# Altium schematic sheet MPPTcharger.SchDoc
size A; SheetNumber: 1; SheetTotal: 10
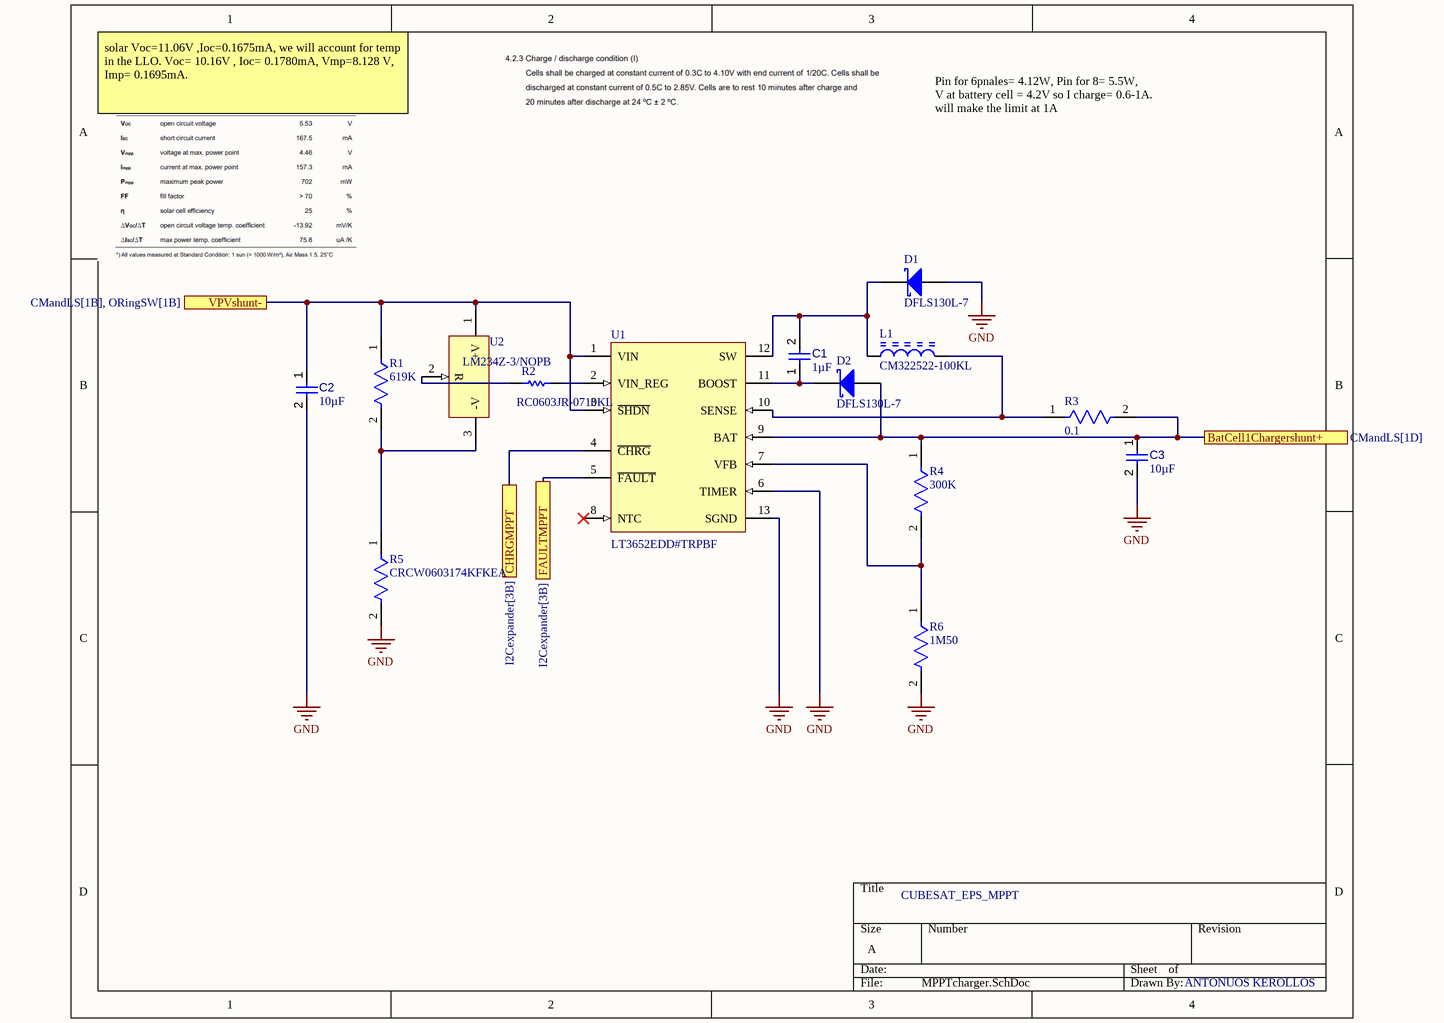
[diagram p0: MPPTcharger.SchDoc]

## Parts
C1  value 1µF  [CAPC0402(1005)60_L]  (hidden comment: Capacitor 1µF +/-20% 10V 0402)
C2  value 10µF  [CAPC0402(1005)60_L]  (hidden comment: Capacitor 10µF +/-40% 6.3V 0402)
C3  value 10µF  [CAPC0402(1005)60_L]  (hidden comment: Capacitor 10µF +/-40% 6.3V 0402)
D1  DFLS130L-7  [DIOD-POWERDI123-2_A_V]
D2  DFLS130L-7  [DIOD-POWERDI123-2_A_V]
L1  CM322522-100KL  [BOUR-CM322522_V]
R1  619K  [FP-CRCW0805-e3-IPC_C]
R2  RC0603JR-0710KL  [RESC1608X55X25ML10T15]
R3  0.1  [FP-ERJ8BW-IPC_A]
R4  300K  [FP-CRCW0402-e3-IPC_C]
R5  CRCW0603174KFKEA  [FP-CRCW0603-e3-IPC_B]
R6  1M50  [FP-CRCW0402-e3-IPC_C]
U1  LT3652EDD#TRPBF  [LT-DD-12_V]
U2  LM234Z-3/NOPB  [LP0003A]

## Ports
BatCell1Chargershunt+ (see CMandLS[1D]), CHRGMPPT (see I2Cexpander[3B]), FAULTMPPT (see I2Cexpander[3B]), VPVshunt- (see CMandLS[1B], ORingSW[1B])

## Nets
GND: C2.2 C3.2 D1.1(A) R5.2 R6.2 U1.6(TIMER) U1.13(SGND)
BatCell1Chargershunt+: C3.1 D2.1(A) R3.2 R4.1 U1.9(BAT) ; port BatCell1Chargershunt+
CHRGMPPT: U1.4(~{CHRG}) ; port CHRGMPPT
FAULTMPPT: U1.5(~{FAULT}) ; port FAULTMPPT
VPVshunt-: C2.1 R1.1 U1.1(VIN) U1.3(~{SHDN}) U2.1(+V) ; port VPVshunt-
NetC1_1: C1.1 D2.2(K) U1.11(BOOST)
NetC1_2: C1.2 D1.2(K) L1.1 U1.12(SW)
NetL1_2: L1.2 R3.1 U1.10(SENSE)
NetR1_2: R1.2 R5.1 U2.3(-V)
NetR2_1: R2.1 U1.2(VIN_REG)
NetR2_2: R2.2 U2.2(R)
NetR4_2: R4.2 R6.1 U1.7(VFB)

Not connected (* = marked no-connect by the designer): U1 8(NTC)*

## Notes on the sheet
- solar Voc=11.06V ,Ioc=0.1675mA, we will account for temp in the LLO. Voc= 10.16V , Ioc= 0.1780mA, Vmp=8.128 V, Imp= 0.1695mA.
- Pin for 6pnales= 4.12W, Pin for 8= 5.5W,                 V at battery cell = 4.2V so I charge= 0.6-1A.                      will make the limit at 1A
- CUBESAT_EPS_MPPT
- ANTONUOS KEROLLOS

## Library data of the parts
C1 = CMP-001-00063-3: Chip Capacitor, 1µF +/-20%, 10V, 0402, Thickness 0.6 mm; Tolerance: 10%; Mounting Technology: SMT; Max Operating Temperature: 85°C; Voltage Rating: 10V; Pins: 2; Case/Package: 0402; Min Operating Temperature: -55°C
C2 C3 = CMP-001-00074-3: Chip Capacitor, 10µF +/-40%, 6.3V, 0402, Thickness 0.6 mm; Tolerance: 10%; Case/Package: 0402; Pins: 2; Mounting Technology: SMT; Voltage Rating: 6.3V; Max Operating Temperature: 85°C; Min Operating Temperature: -55°C
D1 D2 = CMP-2000-07448-1: Schottky Barrier Rectifier, 30 V, 1 A, -40 to 125 degC, 2-Pin SMD, RoHS, Tape and Reel; Manufacturer: Diodes Inc; Max Repetitive Reverse Voltage (Vrrm): 30V; Polarity: Standard; Average Rectified Current: 1A; Element Configuration: Single; Forward Voltage: 360mV; Peak Non-Repetitive Surge Current: 50A; Max Power Dissipation: 1.67W; Case\/Package: SMD/SMT; Capacitance: 76pF; Peak Reverse Current: 1mA; Datasheet URL: https://www.diodes.com/assets/Datasheets/ds30492.pdf; Package Quantity: 3000; Reverse Voltage (DC): 30V; Package Reference: POWERDI123-2_A; Lead Free: LeadFree; Mounting Technology: SurfaceMount; Max Operating Temperature: 125degC; Current Rating: 1A; Radiation Hardening: No; Width: 1.78mm; Height: 0.98mm; Output Current: 1A; Contact Plating: Matte; Length: 2.8mm; Number of Pins: 2; Voltage Rating (DC): 30V; RoHSCompliant: true; Termination: SMD/SMT; Forward Current: 1A; Min Operating Temperature: -40degC; Datasheet Version: Rev. 4-2, 06/2009; Packaging: TapeandReel; REACH SVHC: NoSVHC; Max Forward Surge Current (Ifsm): 50A; Manufacturer URL: http://www.diodes.com/; Mount: SurfaceMount; Package Description: 2-Pin Small Outline Diode, Body 2.8 x 1.78 mm
L1 = CMP-1747-00008-1: Chip Inductor / , 10 uH, +/- 10%, -40 to 125 degC, 1210 (3225 Metric), RoHS, Tape and Reel; Current Rating: 1.5 A; Colour: White; Gender: Female; Connector Type: USB; Min Operating Temperature: -55 degC; ComponentLink2Description: Datasheet; Packaging: Tray; Contact Material: Bronze; ComponentLink1Description: Manufacturer URL; PackageDescription: 2-Pin Surface Mount Device, Body 3.2 x 2.5 mm; Contact Plating: Gold; Max Operating Temperature: 85 degC; ComponentLink2URL: http://www.bourns.com/docs/Product-Datasheets/cm322522.pdf; PackageReference: 1210; Radiation Hardening: No; DatasheetVersion: Aug-14; Package Quantity: 100; Pins: 4; Mount: Through Hole; Lead Pitch: 2.5 mm; ComponentLink1URL: http://www.bourns.com/; Height: 15.9 mm; RoHSCompliant: true; Width: 11.15 mm
R1 = CMP-2001-04045-2: RES Thick Film, 619kΩ, 1%, 0.125W, 100ppm/°C, 0805; Voltage Rating: 150V; Power Rating: 125mW; Resistance: 619kR; Width: 0.049inch; Lead Free: Lead Free; Case/Package: 0805; Termination: SMD/SMT; Height: 0.02inch; Composition: Thick Film; Depth: 1.25mm; Max Operating Temperature: 155°C; Voltage Rating (DC): 150V; Temperature Coefficient: 100ppm/°C; Military Standard: Not; Working Voltage: 150V; Radiation Hardening: No; Weight: 0.000194oz; Min Operating Temperature: -55°C; Features: Automotive AEC-Q200; Case Code (Metric): 2012; Case Code (Imperial): 0805; Number of Terminations: 2; Tolerance: 1%; Contact Plating: Tin; Max Power Dissipation: 125mW; Length: 2mm; Packaging: Tape and Reel; Number of Pins: 2; Package Quantity: 10
R2 = CMP-2000-05022-1: Resistor, 10 KOhm, +/- 5%, 100 mW, -55 to 155 degC, 0603 (1608 Metric), RoHS, Tape and Reel; Manufacturer: Yageo; Resistance: 10kOhms; Voltage Rating: 50V; Temperature Coefficient: 100PPM/C; Power Rating: 100mW; Package Reference: 603; Series: RC; Case Code - mm: 1608; Packaging: Reel; Datasheet URL: http://www.farnell.com/datasheets/443971.pdf; Datasheet Version: Rev. 4, 04/2009; Operating Temperature Range: -55Cto+155C; Product: ThickFilmResistorsGeneralPurpose; Package Description: 2-Pin Surface Mount Device, Body 1.6 x 0.8 mm; Manufacturer URL: http://www.yageo.com/; Case Code - in: 0603; Tolerance: 5%; Termination Style: SMD/SMT
R3 = CMP-2003-00785-2: RES 0.1 OHM 1% 1W 1206; Resistance: 100mR; Temperature Coefficient: 100ppm/°C; Lead Free: Lead Free; Features: Automotive AEC-Q200; Case/Package: 1206; Width: 0.063inch; Radiation Hardening: No; Power Rating: 1W; Resistance Tolerance: 1%; Resistor Type: Thick Film; Max Power Dissipation: 1W; Case Code (Metric): 3216; Package Quantity: 1; Tolerance: 1%; Number of Terminations: 2; Number of Pins: 2; Length: 3.2mm; Case Code (Imperial): 1206; Size Code: 1206; Mount: Surface Mount; Height: 0.65mm; Termination: SMD/SMT; Min Operating Temperature: -55°C; Packaging: Tape and Reel; Military Standard: Not; Series: ERJ; Depth: 1.6mm; REACH SVHC: No SVHC; Max Operating Temperature: 155°C; Contact Plating: Tin; Technology: THICK FILM; RoHS Compliant: Yes; Construction: Rectangular
R4 = CMP-2002-08495-2: RES Thick Film, 300kΩ, 1%, 0.063W, 100ppm/°C, 0402; Power Rating: 63mW; Resistance: 300kR; Voltage Rating: 50V; Case/Package: 0402; Number of Pins: 2; Depth: 0.5mm; Temperature Coefficient: 100ppm/°C; Composition: Thick Film; Length: 1mm; Termination: SMD/SMT; Tolerance: 1%; Features: Automotive AEC-Q200; Max Power Dissipation: 63mW; Packaging: Tape and Reel; Military Standard: Not; Case Code (Metric): 1005; Voltage Rating (DC): 50V; Lead Free: Lead Free; Max Operating Temperature: 155°C; Min Operating Temperature: -55°C; Width: 0.02inch; Package Quantity: 10; Height: 0.35mm; Case Code (Imperial): 0402; Number of Terminations: 2; Mount: Surface Mount; Radiation Hardening: No; Contact Plating: Tin; Weight: 2.3E-05oz
R5 = CMP-2000-02943-2: RES Thick Film, 174kΩ, 1%, 0.1W, 100ppm/°C, 0603; Power Rating: 100mW; Resistance: 174kR; Voltage Rating: 75V; Military Standard: Not; Max Operating Temperature: 155°C; Min Operating Temperature: -55°C; Radiation Hardening: No; Depth: 0.85mm; Composition: Thick Film; Width: 0.033inch; Max Power Dissipation: 100mW; Case Code (Imperial): 0603; Number of Pins: 2; Contact Plating: Tin; Number of Terminations: 2; Temperature Coefficient: 100ppm/°C; Features: Automotive AEC-Q200; Packaging: Tape and Reel; Length: 1.55mm; Weight: 7.1E-05oz; Termination: SMD/SMT; Case Code (Metric): 1608; Tolerance: 1%; Height: 0.02inch; Case/Package: 0603; Package Quantity: 10
R6 = CMP-2002-08330-2: RES Thick Film, 1.5MΩ, 1%, 0.063W, 100ppm/°C, 0402; Max Power Dissipation: 63mW; Voltage Rating: 50V; Resistance: 1.5MR; Military Standard: Not; Height: 0.35mm; Temperature Coefficient: 100ppm/°C; Max Operating Temperature: 155°C; Case Code (Metric): 1005; Case Code (Imperial): 0402; Number of Pins: 2; Radiation Hardening: No; Composition: Thick Film; Contact Plating: Tin; Case/Package: 0402; Features: Automotive AEC-Q200; Package Quantity: 10; Depth: 0.5mm; Weight: 2.3E-05oz; Mount: Surface Mount; Number of Terminations: 2; Min Operating Temperature: -55°C; Lead Free: Lead Free; Length: 1mm; Tolerance: 1%; Power Rating: 63mW; Voltage Rating (DC): 50V; Packaging: Tape and Reel; Termination: SMD/SMT; Width: 0.02inch
U1 = CMP-0473-00065-1: Power Tracking 2 A Battery Charger for Solar Power, 12-pin SON (DD-12), -40 to 125 degC, Pb-Free, Tape and Reel; Manufacturer: Linear Technology; Number of Outputs: 1; Vin Max(V): 32; Vin Min(V): 4.95; ComponentLink2URL: http://cds.linear.com/docs/en/datasheet/3652fd.pdf; ComponentLink3Description: Package Specification; Topology: Battery Charger; ComponentLink1URL: http://www.linear.com/; Energy Source: Solar; RoHS: TRUE; ComponentLink2Description: Datasheet; Packing: Tape and Reel; DatasheetVersion: Rev. D; PackageVersion: Rev. A, 06/2010; PartNumber: LT3652EDD#TRPBF; PackageReference: DD-12; Mounting Technology: Surface Mount; PackageDescription: 12-Pin Plastic DFN, Body 3 x 3 mm, Pitch 0.45 mm; ComponentLink3URL: http://cds.linear.com/docs/en/packaging/DFN_12_05-08-1725.pdf; ComponentLink1Description: Manufacturer URL
U2 = CMP-0063-00072-3: 3-Terminal Adjustable Current Source, 3-pin TO-92, Pb-Free; Manufacturer: Texas Instruments; PowerWise: N; CompType: MiscPower; PackageTopMarking: NSXYTT*LM234*Z-3; RoHS: Y; PinCount: 3; PackageDescription: TO-92, Molded, 3 Lead; Code_JEDEC: TO-226-AA; PackageReference: LP0003A; ComponentLink1URL: http://www.ti.com/general/docs/lit/getliterature.tsp?genericPartNumber=LM234&fileType=pdf; ComponentLink1Description: Datasheet URL